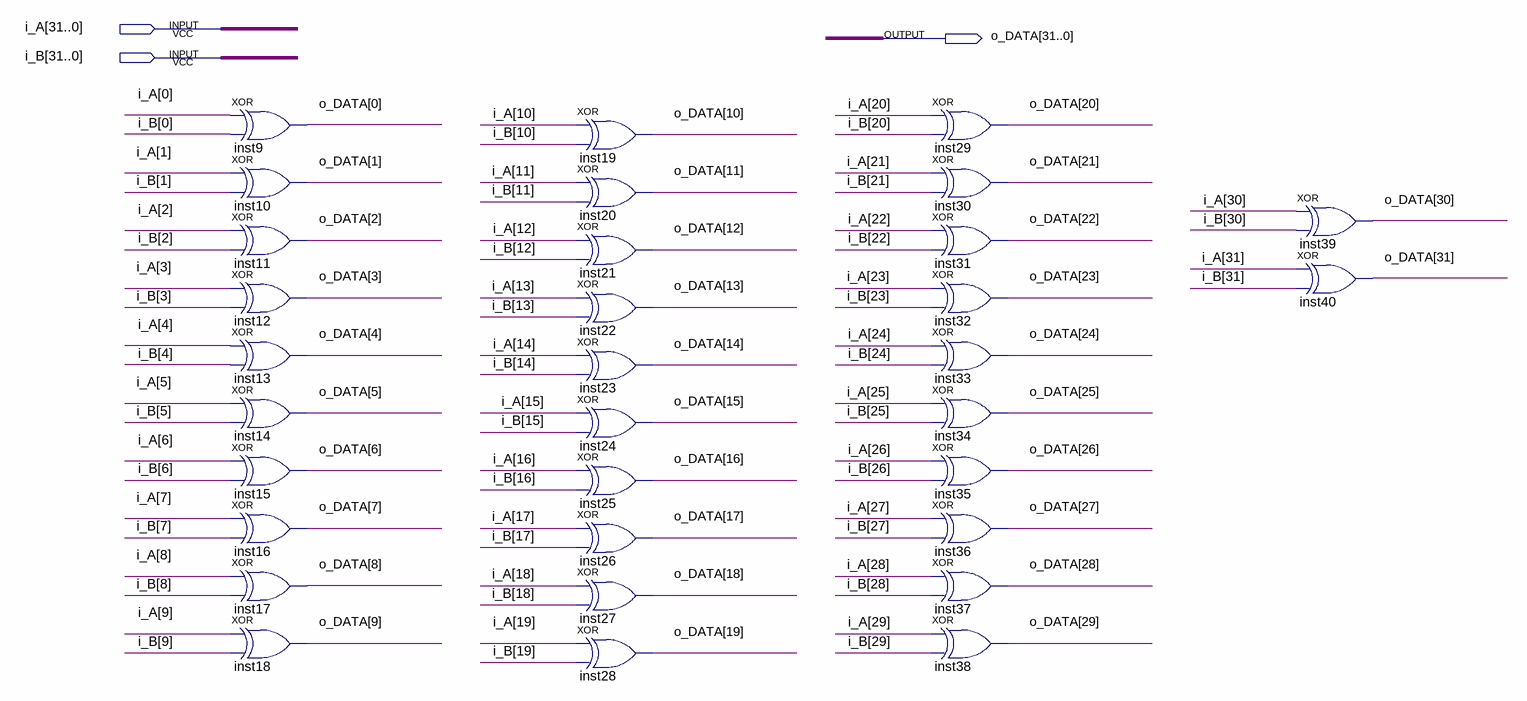
[diagram p0: schematic sheet]
// Quartus schematic xor32.bdf as structural Verilog: 32 symbols, 3 pins
module xor32 (
  input  [31:0] i_A,
  input  [31:0] i_B,
  output [31:0] o_DATA
);

  xor inst9 (o_DATA[0], i_A[0], i_B[0]);
  xor inst10 (o_DATA[1], i_A[1], i_B[1]);
  xor inst11 (o_DATA[2], i_A[2], i_B[2]);
  xor inst12 (o_DATA[3], i_A[3], i_B[3]);
  xor inst13 (o_DATA[4], i_A[4], i_B[4]);
  xor inst14 (o_DATA[5], i_A[5], i_B[5]);
  xor inst15 (o_DATA[6], i_A[6], i_B[6]);
  xor inst16 (o_DATA[7], i_A[7], i_B[7]);
  xor inst17 (o_DATA[8], i_A[8], i_B[8]);
  xor inst18 (o_DATA[9], i_A[9], i_B[9]);
  xor inst19 (o_DATA[10], i_A[10], i_B[10]);
  xor inst20 (o_DATA[11], i_A[11], i_B[11]);
  xor inst21 (o_DATA[12], i_A[12], i_B[12]);
  xor inst22 (o_DATA[13], i_A[13], i_B[13]);
  xor inst23 (o_DATA[14], i_A[14], i_B[14]);
  xor inst24 (o_DATA[15], i_A[15], i_B[15]);
  xor inst25 (o_DATA[16], i_A[16], i_B[16]);
  xor inst26 (o_DATA[17], i_A[17], i_B[17]);
  xor inst27 (o_DATA[18], i_A[18], i_B[18]);
  xor inst28 (o_DATA[19], i_A[19], i_B[19]);
  xor inst29 (o_DATA[20], i_A[20], i_B[20]);
  xor inst30 (o_DATA[21], i_A[21], i_B[21]);
  xor inst31 (o_DATA[22], i_A[22], i_B[22]);
  xor inst32 (o_DATA[23], i_A[23], i_B[23]);
  xor inst33 (o_DATA[24], i_A[24], i_B[24]);
  xor inst34 (o_DATA[25], i_A[25], i_B[25]);
  xor inst35 (o_DATA[26], i_A[26], i_B[26]);
  xor inst36 (o_DATA[27], i_A[27], i_B[27]);
  xor inst37 (o_DATA[28], i_A[28], i_B[28]);
  xor inst38 (o_DATA[29], i_A[29], i_B[29]);
  xor inst39 (o_DATA[30], i_A[30], i_B[30]);
  xor inst40 (o_DATA[31], i_A[31], i_B[31]);
endmodule
